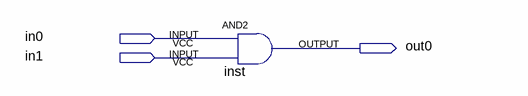
[diagram p0: schematic sheet]
// Quartus schematic ANDgate.bdf as structural Verilog: 1 symbols, 3 pins
module ANDgate (
  input  in0,
  input  in1,
  output out0
);

  and inst (out0, in0, in1);
endmodule
